# EAGLE schematic MicroIMU (EAGLE 7.6.0)
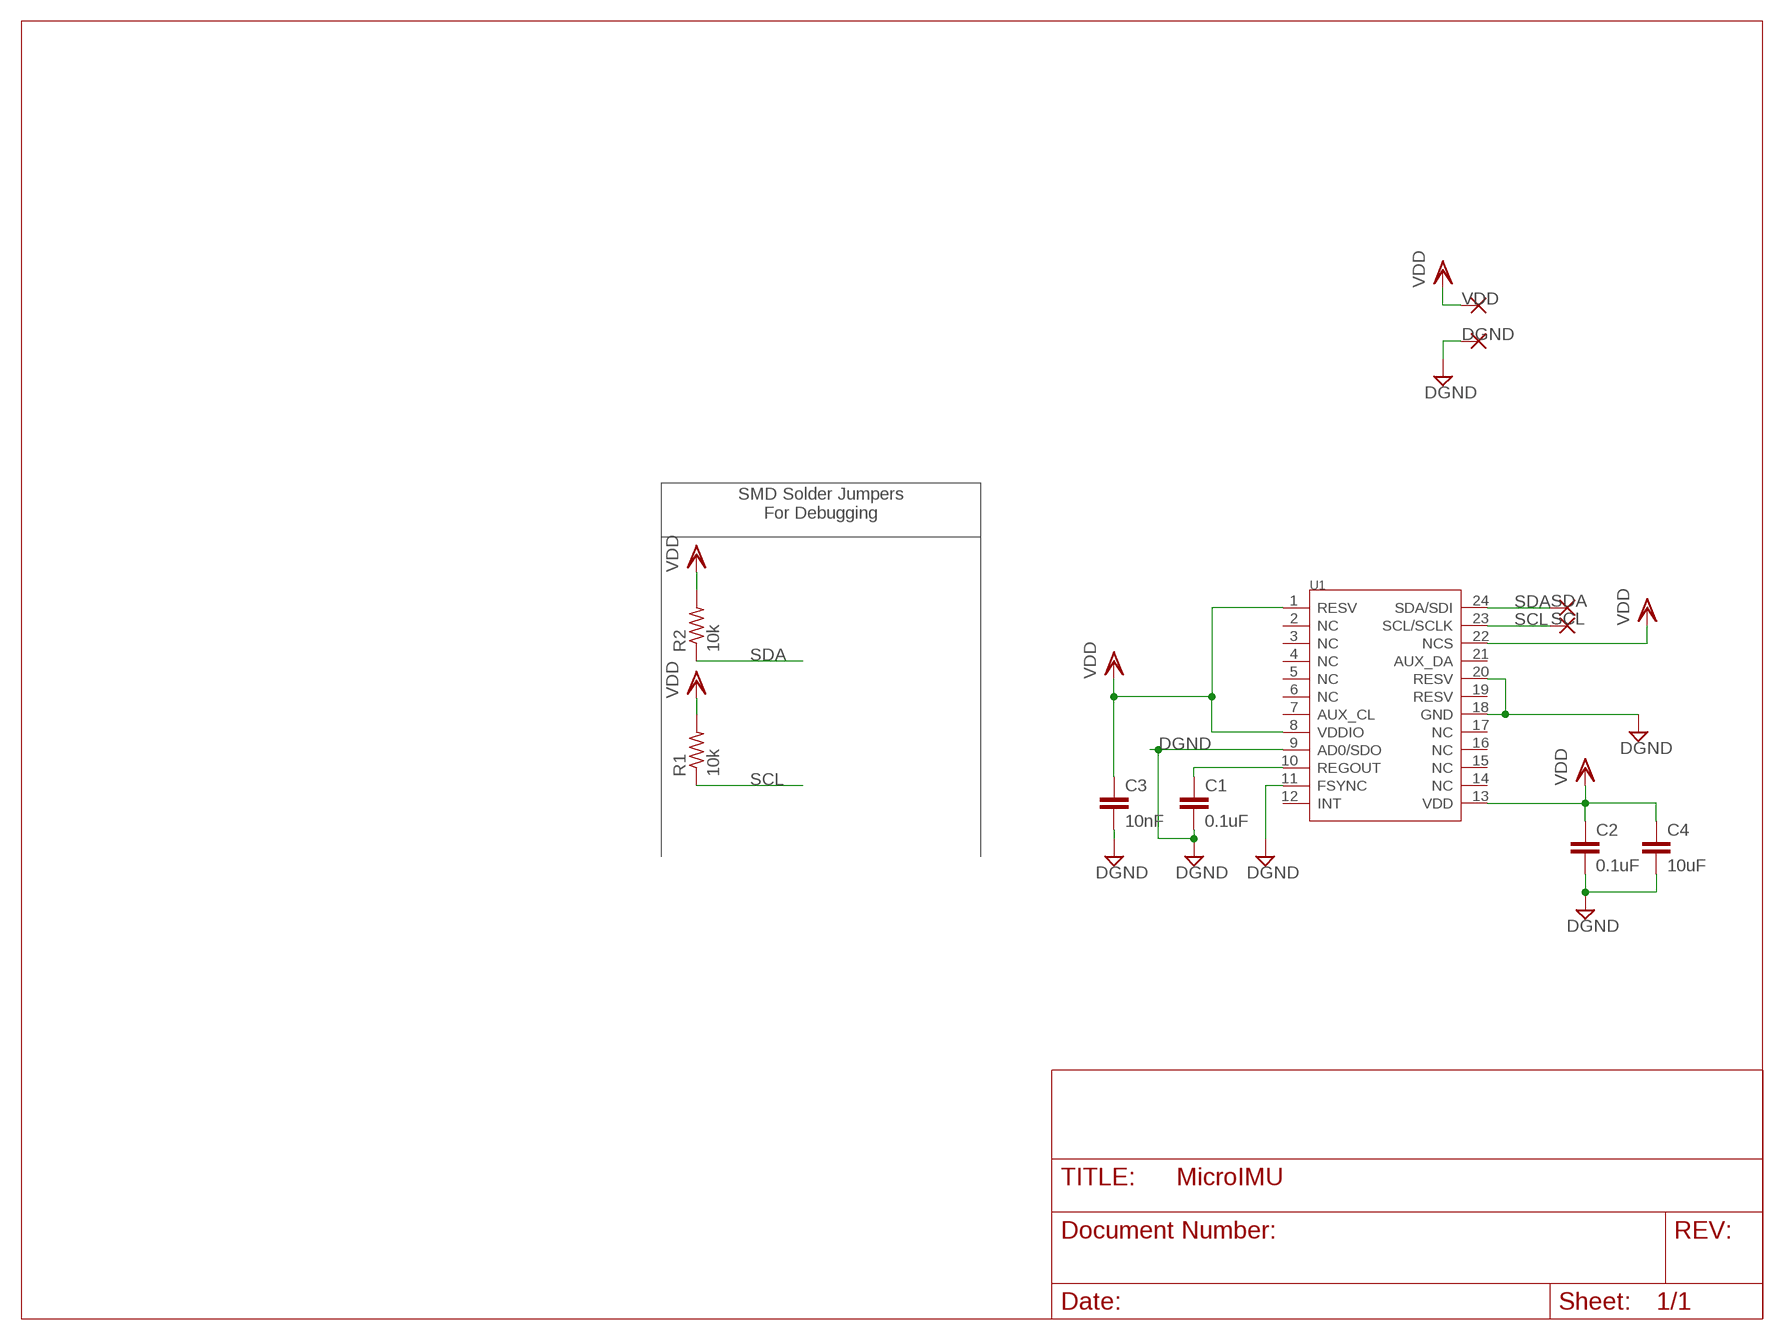
[diagram p0: schematic, sheet 1]

## Parts
C1  0.1uF  C-EUC0402  [C0402]
C2  0.1uF  C-EUC0402  [C0402]
C3  10nF  C-EUC0402  [C0402]
C4  10uF  C-EUC0603  [C0603]
DGND  THROUGH-HOLE-30MIL/15MIL  [30MIL/15MIL]
R1  10k  R-US_R0201  [R0201]
R2  10k  R-US_R0201  [R0201]
SCL  THROUGH-HOLE-30MIL/15MIL  [30MIL/15MIL]
SDA  THROUGH-HOLE-30MIL/15MIL  [30MIL/15MIL]
U1  MPU-9250  [LEAD-QFN24]
VDD  THROUGH-HOLE-30MIL/15MIL  [30MIL/15MIL]

## Nets
DGND: C1.2 C2.2 C3.2 C4.2 DGND.P$1(P) U1.9(AD0/SDO) U1.11(FSYNC) U1.18(GND) U1.20(RESV)
N$7: C1.1 U1.10(REGOUT)
SCL: R1.1 SCL.P$1(P) U1.23(SCL/SCLK)
SDA: R2.1 SDA.P$1(P) U1.24(SDA/SDI)
VDD: C2.1 C3.1 C4.1 R1.2 R2.2 U1.1(RESV) U1.8(VDDIO) U1.13(VDD) U1.22(NCS) VDD.P$1(P)
Unconnected: U1.2(NC) U1.3(NC) U1.4(NC) U1.5(NC) U1.6(NC) U1.7(AUX_CL) U1.12(INT) U1.14(NC) U1.15(NC) U1.16(NC) U1.17(NC) U1.19(RESV) U1.21(AUX_DA)

## Notes on the sheet
- SMD Solder Jumpers
  For Debugging

## Library data of the parts
C1-C4 = resistor:C-EU: CAPACITOR, European symbol
DGND SCL SDA VDD = michael-stetner:THROUGH-HOLE-30MIL/15MIL: THROUGH-HOLE PAD
R1 R2 = resistor:R-US_: RESISTOR, American symbol
U1 = Grove - IMU 10DOF v1.1:MPU-9250